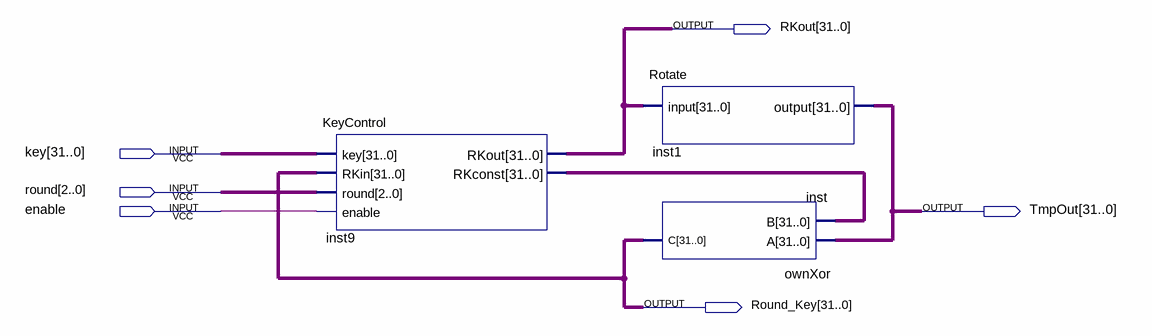
[diagram p0: schematic sheet]
// Quartus schematic KeyTest.bdf as structural Verilog: 3 symbols, 6 pins
module KeyTest (
  input  [31:0] key,
  input  [2:0] round,
  input  enable,
  output [31:0] RKout,
  output [31:0] TmpOut,
  output [31:0] Round_Key
);

  wire [31:0] inst9_rkconst;

  KeyControl inst9 (
    .key(key), .RKin(Round_Key), .round(round), .enable(enable), .RKout(RKout), .RKconst(inst9_rkconst));
  Rotate inst1 (.\input (RKout), .\output (TmpOut));
  ownXor inst (.A(TmpOut), .B(inst9_rkconst), .C(Round_Key));
endmodule
